# EAGLE design xiao-extension (EAGLE 9.6.2)
CNAME: BotaLab; CREVISION: 1.1; DESIGNER: botamochi6277
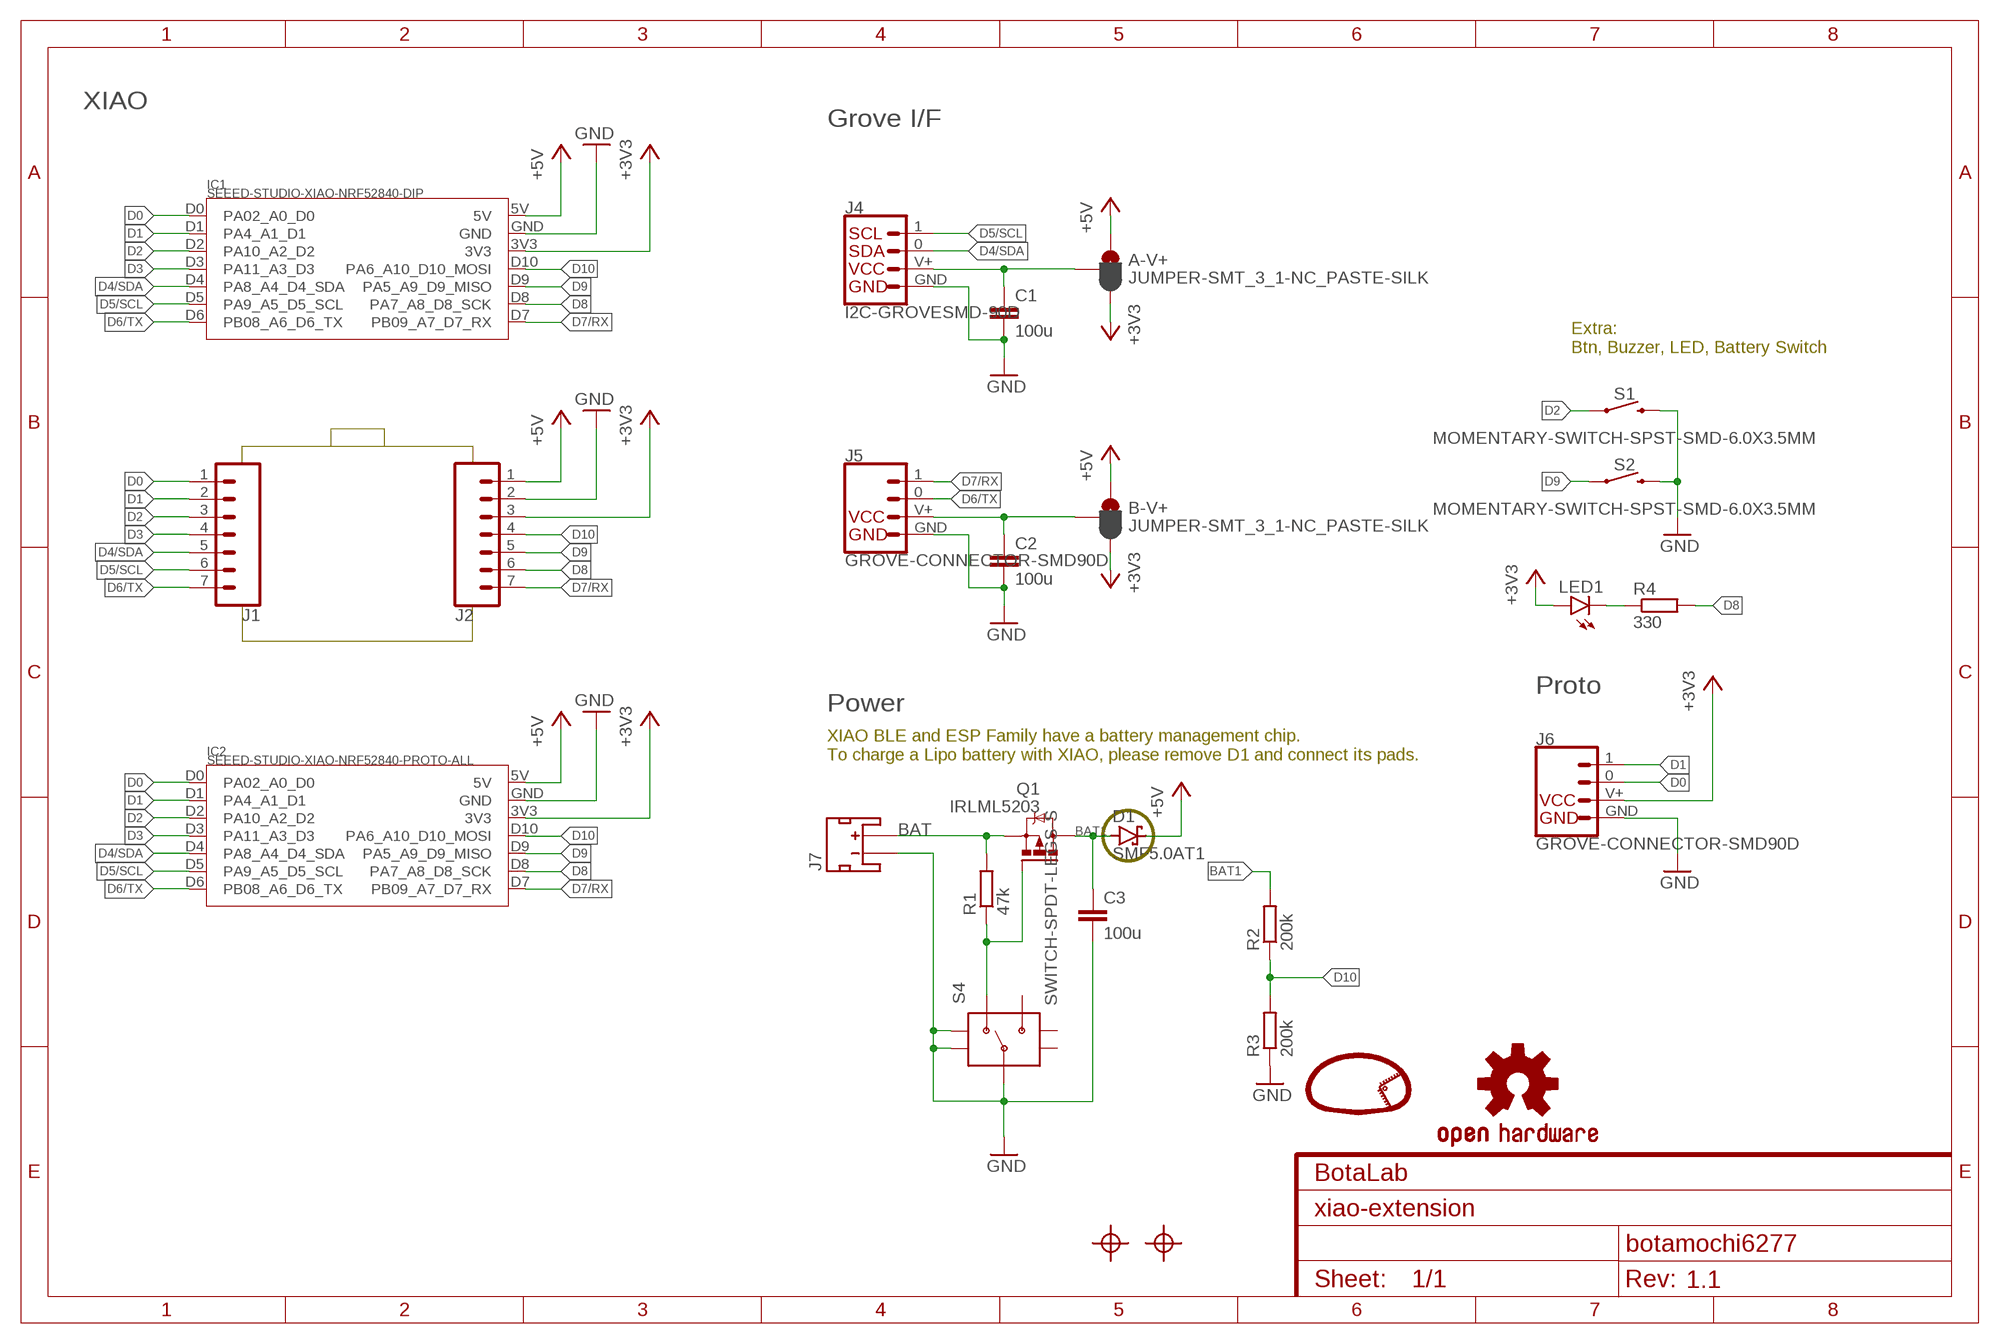
[diagram p0: schematic, sheet 1]

## Parts
A-V+  JUMPER-SMT_3_1-NC_PASTE-SILK  [SMT-JUMPER_3_1-NC_PASTE_SILK]
B-V+  JUMPER-SMT_3_1-NC_PASTE-SILK  [SMT-JUMPER_3_1-NC_PASTE_SILK]
C1  100u  C-EUC3216  [C3216]
C2  100u  C-EUC3216  [C3216]
C3  100u  C-EUC3216  [C3216]
D1  SMF5.0AT1  [SOD123FL]
H1  HOLE-SILK-2.1  [MOUNTING_HOLE_SILK_2.1]
H2  HOLE-SILK-2.1  [MOUNTING_HOLE_SILK_2.1]
IC1  SEEED-STUDIO-XIAO-NRF52840-DIP  [XIAO-NRF52840-DIP]
IC2  SEEED-STUDIO-XIAO-NRF52840-PROTO-ALL  [XIAO-SMD-PROTO]
J1  CONN_07NO_SILK  [1X07_NO_SILK]
J2  CONN_07NO_SILK  [1X07_NO_SILK]
J4  I2C-GROVESMD-90D  [HW4-SMD-2.0-90D]
J5  GROVE-CONNECTOR-SMD90D  [HW4-SMD-2.0-90D]
J6  GROVE-CONNECTOR-SMD90D  [HW4-SMD-2.0-90D]
J7  JST_2MM_MALE  [JST-2-SMD]
LED1  LEDCHIP-LED0603  [CHIP-LED0603]
LOGO1  LOGO  [LOGO]
LOGO2  OSHW-LOGOS  [OSHW-LOGO-S]
Q1  IRLML5203  [MICRO3]
R1  47k  R-EU_R0603  [R0603]
R2  200k  R-EU_R0603  [R0603]
R3  200k  R-EU_R0603  [R0603]
R4  330  R-EU_R0603  [R0603]
S1  MOMENTARY-SWITCH-SPST-SMD-6.0X3.5MM  [TACTILE_SWITCH_SMD_6.0X3.5MM]
S2  MOMENTARY-SWITCH-SPST-SMD-6.0X3.5MM  [TACTILE_SWITCH_SMD_6.0X3.5MM]
S4  SWITCH-SPDT-LEGS-S  [SWITCH_SPST_SMD_A]

## Nets
+3V3 [pwr]: A-V+.3 B-V+.3 IC1.3V3 IC2.3V3 J2.3 J6.V+(VCC) LED1.A
+5V [pwr]: A-V+.1 B-V+.1 D1.C IC1.5V IC2.5V J2.1
BAT [pwr]: J7.2(+) Q1.2(S) R1.2
BAT1 [pwr]: C3.1 D1.A Q1.3(D) R2.2
D0: IC1.D0(PA02_A0_D0) IC2.D0(PA02_A0_D0) J1.1 J6.0
D1: IC1.D1(PA4_A1_D1) IC2.D1(PA4_A1_D1) J1.2 J6.1
D2: IC1.D2(PA10_A2_D2) IC2.D2(PA10_A2_D2) J1.3 S1.1
D3: IC1.D3(PA11_A3_D3) IC2.D3(PA11_A3_D3) J1.4
D4/SDA: IC1.D4(PA8_A4_D4_SDA) IC2.D4(PA8_A4_D4_SDA) J1.5 J4.0
D5/SCL: IC1.D5(PA9_A5_D5_SCL) IC2.D5(PA9_A5_D5_SCL) J1.6 J4.1
D6/TX: IC1.D6(PB08_A6_D6_TX) IC2.D6(PB08_A6_D6_TX) J1.7 J5.0
D7/RX: IC1.D7(PB09_A7_D7_RX) IC2.D7(PB09_A7_D7_RX) J2.7 J5.1
D8: IC1.D8(PA7_A8_D8_SCK) IC2.D8(PA7_A8_D8_SCK) J2.6 R4.2
D9: IC1.D9(PA5_A9_D9_MISO) IC2.D9(PA5_A9_D9_MISO) J2.5 S2.1
D10: IC1.D10(PA6_A10_D10_MOSI) IC2.D10(PA6_A10_D10_MOSI) J2.4 R2.1 R3.2
GND [pwr]: C1.2 C2.2 C3.2 IC1.GND IC2.GND J2.2 J4.GND J5.GND J6.GND J7.1(-) R3.1 S1.2 S2.2 S4.2(P) S4.L$1 S4.L$2
N$1 [pwr]: A-V+.2 C1.1 J4.V+
N$2 [pwr]: B-V+.2 C2.1 J5.V+(VCC)
N$3: Q1.1(G) R1.1 S4.1(O)
N$4: LED1.C R4.1
Unconnected: J7.NC1(PAD1) J7.NC2(PAD2) S4.3(S) S4.L$3 S4.L$4

## Notes on the sheet
- XIAO
- Grove I/F
- Extra:
  Btn, Buzzer, LED, Battery Switch
- Proto
- Power
- XIAO BLE and ESP Family have a battery management chip.
  To charge a Lipo battery with XIAO, please remove D1 and connect its pads.

## Library data of the parts
A-V+ B-V+ = Botamochi-Jumper:JUMPER-SMT_3_1-NC_PASTE
C1-C3 = rcl:C-EU: CAPACITOR, European symbol; SPICEPREFIX: C
D1 = diode:SMF5.0AT1: 200 W Transient Voltage Suppressor Source: Data sheet <http://www.onsemi.com/pub_link/Collateral/SMF5.0AT1-D.PDF>
H1 H2 = Botamochi-Hole:HOLE
IC1 IC2 = Seeed Studio XIAO:SEEED-STUDIO-XIAO-NRF52840
J1 J2 = SparkFun-Connectors:CONN_07: Multi connection point. Often used as Generic Header-pin footprint for 0.1 inch spaced/style header connections On any of the 0.1 inch spaced packages, you can populate with these: Break Away Headers - Straight <https://www.sparkfun.com/products/116> (PRT-00116) Break Away Male Headers - Right Angle <https://www.sparkfun.com/products/553> (PRT-00553) Female Headers <https://www.sparkfun.com/products/115> (PRT-00115) Break Away Headers - Machine Pin <https://www.sparkfun.com/products/117> (PRT-00117) Break Away Female Headers - Swiss Machine Pin <https://www.sparkfun.com/products/743> (PRT-00743) For SCREWTERMINALS and SPRING TERMINALS visit here: Screw Terimnals on SparkFun.com <https://www.sparkfun.com/search/results?term=Screw+Terminals> (5mm/3.5mm/2.54mm spacing) This device is also useful as a general connection point to wire up your design to another part of your project. Our various solder wires solder well into these plated through hole pads. Hook-Up Wire - Assortment (Stranded, 22 AWG) <https://www.sparkfun.com/products/11375> (PRT-11375) Hook-Up Wire - Assortment (Solid Core, 22 AWG) <https://www.sparkfun.com/products/11367> (PRT-11367) View the entire wire category on our website here <https://www.sparkfun.com/categories/141> Special notes: Molex polarized connector foot print use with SKU : PRT-08231 with associated crimp pins and housings. 1MM SMD Version SKU: PRT-10208 NOTES ON THE VARIANTS LOCK and LOCK_LONGPADS... This footprint was designed to help hold the alignment of a through-hole component (i.e. 6-pin header) while soldering it into place. You may notice that each hole has been shifted either up or down by 0.005 of an inch from it's more standard position (which is a perfectly straight line). This slight alteration caused the pins (the squares in the middle) to touch the edges of the holes. Because they are alternating, it causes a "brace" to hold the component in place. 0.005 has proven to be the perfect amount of "off-center" position when using our standard breakaway headers. Although looks a little odd when you look at the bare footprint, once you have a header in there, the alteration is very hard to notice. Also,if you push a header all the way into place, it is covered up entirely on the bottom side.
J4 = SEEED-GROVE-CONNECTOR:I2C-GROVE
J5 J6 = SEEED-GROVE-CONNECTOR:GROVE-CONNECTOR-SMD
J7 = SparkFun-Connectors:JST_2MM_MALE: JST 2MM MALE RA CONNECTOR Two pin, compact surface mount connector. Commonly used as a battery input connection point. We really like the solid locking feeling and high current rating on these small connectors. We use these all the time as battery connectors. Mates to single-cell LiPo batteries. Here is the connector we sell at SparkFun: JST Right Angle Connector - White <https://www.sparkfun.com/products/8612> (PRT-08612) Datasheet <http://www.sparkfun.com/datasheets/Prototyping/Connectors/JST-Horizontal.pdf> It was used on these SparkFun products: SparkFun MOSFET Power Controller <https://www.sparkfun.com/products/11214> (PRT-11214) SparkFun Battery Babysitter - LiPo Battery Manager <https://www.sparkfun.com/products/13777> (PRT-13777) And many, many others that required a lipo battery connection.; PROD_ID: CONN-11443; SF_ID: PRT-08612
LED1 = led:LED: LED OSRAM: - CHIPLED LG R971, LG N971, LY N971, LG Q971, LY Q971, LO R971, LY R971 LH N974, LH R974 LS Q976, LO Q976, LY Q976 LO Q996 - Hyper CHIPLED LW Q18S LB Q993, LB Q99A, LB R99A - SideLED LS A670, LO A670, LY A670, LG A670, LP A670 LB A673, LV A673, LT A673, LW A673 LH A674 LY A675 LS A676, LA A676, LO A676, LY A676, LW A676 LS A679, LY A679, LG A679 - Hyper Micro SIDELED® LS Y876, LA Y876, LO Y876, LY Y876 LT Y87S - SmartLED LW L88C, LW L88S LB L89C, LB L89S, LG L890 LS L89K, LO L89K, LY L89K LS L896, LA L896, LO L896, LY L896 - TOPLED LS T670, LO T670, LY T670, LG T670, LP T670 LSG T670, LSP T670, LSY T670, LOP T670, LYG T670 LG T671, LOG T671, LSG T671 LB T673, LV T673, LT T673, LW T673 LH T674 LS T676, LA T676, LO T676, LY T676, LB T676, LH T676, LSB T676, LW T676 LB T67C, LV T67C, LT T67C, LS T67K, LO T67K, LY T67K, LW E67C LS E67B, LA E67B, LO E67B, LY E67B, LB E67C, LV E67C, LT E67C LW T67C LS T679, LY T679, LG T679 LS T770, LO T770, LY T770, LG T770, LP T770 LB T773, LV T773, LT T773, LW T773 LH T774 LS E675, LA E675, LY E675, LS T675 LS T776, LA T776, LO T776, LY T776, LB T776 LHGB T686 LT T68C, LB T68C - Hyper Mini TOPLED® LB M676 - Mini TOPLED Santana® LG M470 LS M47K, LO M47K, LY M47K Source: http://www.osram.convergy.de LUXEON: - LUMILED® LXK2-PW12-R00, LXK2-PW12-S00, LXK2-PW14-U00, LXK2-PW14-V00 LXK2-PM12-R00, LXK2-PM12-S00, LXK2-PM14-U00 LXK2-PE12-Q00, LXK2-PE12-R00, LXK2-PE12-S00, LXK2-PE14-T00, LXK2-PE14-U00 LXK2-PB12-K00, LXK2-PB12-L00, LXK2-PB12-M00, LXK2-PB14-N00, LXK2-PB14-P00, LXK2-PB14-Q00 LXK2-PR12-L00, LXK2-PR12-M00, LXK2-PR14-Q00, LXK2-PR14-R00 LXK2-PD12-Q00, LXK2-PD12-R00, LXK2-PD12-S00 LXK2-PH12-R00, LXK2-PH12-S00 LXK2-PL12-P00, LXK2-PL12-Q00, LXK2-PL12-R00 Source: www.luxeon.com KINGBRIGHT: KA-3528ASYC Source: www.kingbright.com
LOGO1 = botamochi-symbol:LOGO
LOGO2 = SparkFun-Aesthetics:OSHW-LOGO: Open-Source Hardware (OSHW) Logo This logo indicates the piece of hardware it is found on incorporates a OSHW license and/or adheres to the definition of open source hardware found here: http://freedomdefined.org/OSHW
Q1 = transistor-power:IRLML5203: HEXFET P-Channel Power MOSFET
R1-R4 = rcl:R-EU_: RESISTOR, European symbol; SPICEPREFIX: R
S1 S2 = SparkFun-Switches:MOMENTARY-SWITCH-SPST: Momentary Switch (Pushbutton) - SPST Normally-open (NO) SPST momentary switches (buttons, pushbuttons). Variants PTH-12MM - 12mm square, through-hole Momentary Pushbutton Switch - 12mm Square <https://www.sparkfun.com/products/9190> (COM-09190) PTH-6.0MM, PTH-6.0MM-KIT - 6.0mm square, through-hole Mini Pushbutton Switch <https://www.sparkfun.com/products/97> (COM-00097) KIT package intended for soldering kit's - only one side of pads' copper is exposed. PTH-RIGHT-ANGLE-KIT - Right-angle, through-hole Right Angle Tactile Button <https://www.sparkfun.com/products/10791> - Used on SparkFun BigTime Watch Kit <https://www.sparkfun.com/products/11734> SMD-12MM - 12mm square, surface-mount Tactile Button - SMD (12mm) <https://www.sparkfun.com/products/12993> (COM-12993) Used on SparkFun PicoBoard <https://www.sparkfun.com/products/11888> SMD-4.5MM - 4.5mm Square Trackball Switch Used on SparkFun Blackberry Trackballer Breakout <https://www.sparkfun.com/products/13169> SMD-4.6MMX2.8MM - 4.60mm x 2.80mm, surface mount Used on SparkFun SAMD21 Mini Breakout <https://www.sparkfun.com/products/13664> SMD-5.2MM, SMD-5.2-REDUNDANT - 5.2mm square, surface-mount Mini Pushbutton Switch - SMD <https://www.sparkfun.com/products/8720> (COM-08720) Used on Arduino Pro Mini <https://www.sparkfun.com/products/11114> REDUNDANT package connects both switch circuits together SMD-6.0X3.5MM - 6.0 x 3.5mm, surface mount Momentary Reset Switch SMD <https://www.sparkfun.com/products/8229> (COM-08229) SMD-6.2MM-TALL - 6.2mm square, surface mount Tactile Button - SMD (6mm) <https://www.sparkfun.com/products/12992> Used on SparkFun Digital Sandbox <https://www.sparkfun.com/products/12651> SMD-RIGHT-ANGLE - Right-angle, surface mount Used on SparkFun Block for Intel® Edison - Arduino <https://www.sparkfun.com/products/13036>; PROD_ID: SWCH-00815; SF_SKU: COM-08229
S4 = Botamochi-Switch:SWITCH-SPDT-LEGS

## Net classes
0 default: width 0.5 mm
1 pwr: width 0.75 mm, clearance 0.25 mm

## Board
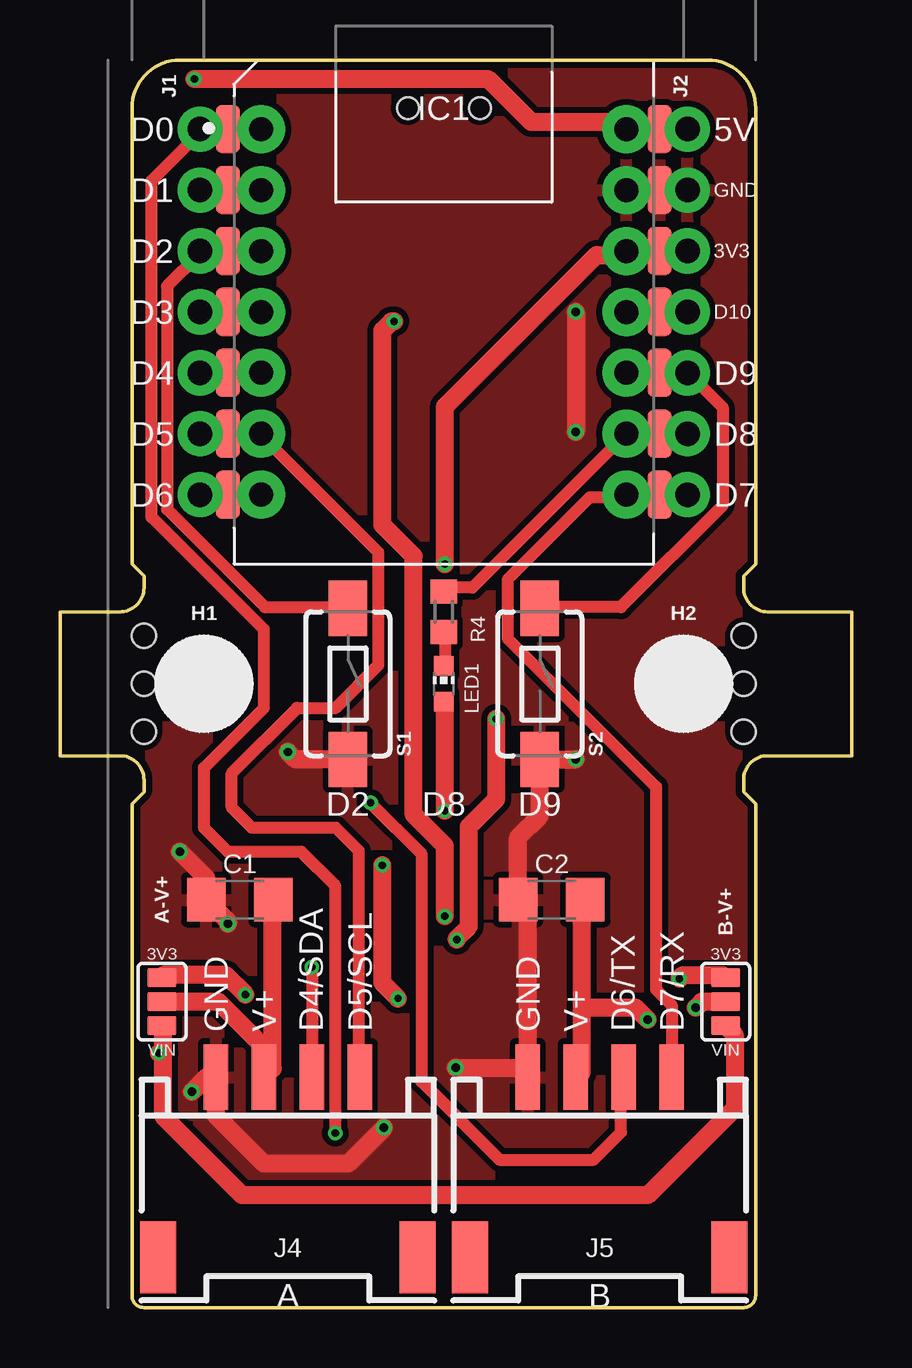
[diagram p1: board, top side]
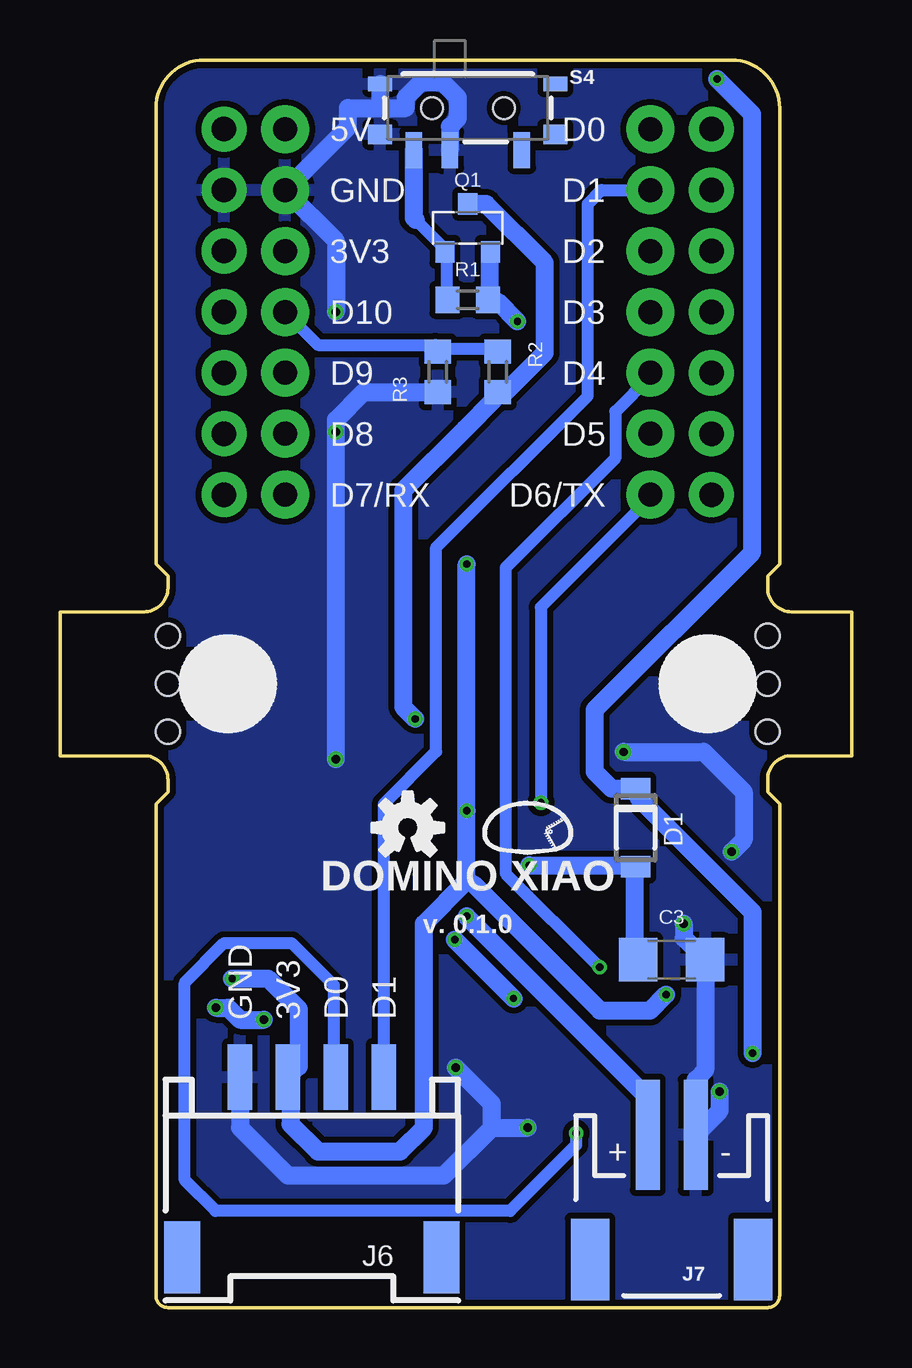
[diagram p2: board, bottom side, seen from below]

Size 33 x 52 mm. Coordinates in mm from the lower left corner, seen from the top.
Outline: 29,0.5 29,21 28.5,21.5 28.5,22 arc-90 29.5,23 33,23 33,29 29.5,29 arc-90 28.5,30 28.5,30.5 29,31 29,50 arc90 27,52 5,52 arc90 3,50 3,31 3.5,30.5 3.5,30 arc-90 2.5,29 0,29 0,23 2.5,23 arc-90 3.5,22 3.5,21.5 3,21 3,0.5 arc90 3.5,0 28.5,0 arc90 29,0.5
Copper layers (1*16): Top 0.035mm / dielectric 1.5mm / Bottom 0.035mm
Design rules "ssci_SeeedStudio_2layer_DRU_no_angle *": minimum track width 0.5mm, minimum drill 12mil, track to track 6mil, track to pad 6mil, pad to pad 6mil, via to via 6mil, smd to smd 0mil, copper to edge 10mil, drill to drill 10mil, minimum pad ring 10mil, minimum via ring 6mil, stop-mask expansion 2mil, vias tented up to drill 25mil, thermal gap 10mil
Holes 1 mm at 28.5,26 28.5,28 28.5,24 3.5,28 3.5,26 3.5,24

### Footprints (pad centres in the part's own frame; a part is rotated, then mirrored left to right if it is on the bottom)
SMT-JUMPER_3_1-NC_PASTE_SILK = smd 0.75 x 1.2: 1 -1,0; 2 0,0; 3 1,0
C3216 = smd 1.6 x 1.8: 1 -1.4,0; 2 1.4,0
SOD123FL = smd 0.91 x 1.22: A 1.625,0; C -1.625,0
MOUNTING_HOLE_SILK_2.1 = hole 2.1: 0,0
XIAO-NRF52840-DIP = drill 1 pad 2: 3V3 7.62,-7.96; 5V 7.62,-2.88; D0 -7.62,-2.88; D1 -7.62,-5.42; D2 -7.62,-7.96; D3 -7.62,-10.5; D4 -7.62,-13.04; D5 -7.62,-15.58; D6 -7.62,-18.12; D7 7.62,-18.12; D8 7.62,-15.58; D9 7.62,-13.04; D10 7.62,-10.5; GND 7.62,-5.42
XIAO-SMD-PROTO = smd 1 x 2: 3V3 9,-7.96; 5V 9,-2.88; D0 -9,-2.88; D1 -9,-5.42; D2 -9,-7.96; D3 -9,-10.5; D4 -9,-13.04; D5 -9,-15.58; D6 -9,-18.12; D7 9,-18.12; D8 9,-15.58; D9 9,-13.04; D10 9,-10.5; GND 9,-5.42
1X07_NO_SILK = drill 1.016 pad 1.88: 1 0,0; 2 2.54,0; 3 5.08,0; 4 7.62,0; 5 10.16,0; 6 12.7,0; 7 15.24,0
HW4-SMD-2.0-90D = smd 1.01 x 2.74: 0 -1,-0.1; 1 -3,-0.1; GND 3,-0.1; V+ 1,-0.1 | smd 1.5 x 3: SS1 -5.4,7.4; SS2 5.4,7.4
JST-2-SMD = smd 1 x 4.6: 1 -1,-3.7; 2 1,-3.7 | smd 1.6 x 3.4: NC1 -3.4,1.5; NC2 3.4,1.5
CHIP-LED0603 = smd 0.8 x 0.8: A 0,-0.75; C 0,0.75
MICRO3 = smd 0.8 x 0.9: 1 -0.95,-1; 2 0.95,-1; 3 0,1
R0603 = smd 1 x 1.1: 1 -0.85,0; 2 0.85,0
TACTILE_SWITCH_SMD_6.0X3.5MM = smd 2.3 x 1.6: 1 -3.15,0; 2 3.15,0
SWITCH_SPST_SMD_A = smd 0.7 x 1.5: 1 -2.25,-1.75; 2 -0.75,-1.75; 3 2.25,-1.75 | smd 1 x 0.6: L$1 -3.65,1; L$4 3.65,1 | smd 1 x 0.8: L$2 -3.65,-1.1; L$3 3.65,-1.1 | hole 0.9: -1.5,0; 1.5,0

### Placement (x,y rotation side)
A-V+  4.25,12.75 90 top
B-V+  27.75,12.75 90 top
C1  7.5,17 180 top
C2  20.5,17 180 top
C3  7.5,14.5 0 bottom
D1  9,20 270 bottom
H1  6,26 0 top
H2  26,26 0 top
IC1  16,52 0 top
IC2  16,52 0 top
J1  5.84,49.12 270 top
J2  26.16,49.12 270 top
J4  9.5,9.5 180 top
J5  22.5,9.5 180 top
J6  22.5,9.5 180 bottom
J7  7.5,3.5 180 bottom
LED1  16,26 0 top
LOGO1  13.5,20 0 bottom
LOGO2  18.5,20 0 bottom
Q1  16,45 0 bottom
R1  16,42 0 bottom
R2  14.75,39 270 bottom
R3  17.25,39 90 bottom
R4  16,29 90 top
S1  12,26 270 top
S2  20,26 270 top
S4  16,50 0 bottom

### Tracks (layer width: path | path; a pad name or v marks a point on that pad's centre or on a via)
+3V3  (via drill 0.3)
  Top 0.75: J2.3 26,44.04 25.02,44.04 IC2.3V3 24.69,44.04 23.71,44.04 IC1.3V3 23.39,43.87 22.37,43.87 16.05,37.55 v16.05,30.99 | v16.05,20.71 16.05,25.12 LED1.A | v7.73,13.05 6.91,13.86 4.3,13.86 A-V+.3 | v25.82,13.71 25.98,13.86 27.63,13.86 B-V+.3
  Bottom 0.75: 16.05,17.78 v16.05,20.71 v16.05,30.99 | 16.05,17.78 17.83,15.99 17.83,7.49 18.82,6.5 22.25,6.5 23.39,7.64 23.39,9.46 J6.V+ 23.05,10.05 23.05,12.44 24.32,13.71 v25.82,13.71 | v7.73,13.05 8.39,12.38 10.49,12.38 15.72,17.61 16.05,17.78
+5V  (via drill 0.3)
  Top 0.75: J2.1 26,49.26 25.02,49.26 IC2.5V 24.69,49.26 23.71,49.26 IC1.5V 23.39,49.42 19.64,49.42 17.84,51.21 v5.61,51.21 | 4.3,10.6 4.3,7.97 7.59,4.69 24.51,4.69 28.13,8.31 28.13,11.37 B-V+.1 | 4.3,10.6 4.3,11.74 A-V+.1 | v4.13,10.6 4.3,10.6
  Bottom 0.75: v4.13,10.6 4.13,16.48 8.87,21.22 8.87,21.53 D1.C 10,21.62 10.71,22.33 10.71,24.91 4.14,31.48 4.14,49.74 v5.61,51.21
BAT  (via drill 0.3)
  Top 0.75: v13.93,41.1 13.82,41.1 13.44,40.72 13.44,32.62 14.74,31.32 14.74,20.55 16.05,19.25 v16.05,16.31
  Bottom 0.75: Q1.2 15.07,43.87 15.07,42.08 R1.2 14.74,41.92 v13.93,41.1 | v16.05,16.31 8.54,8.81 8.54,7.34 J7.2
BAT1  (via drill 0.3)
  Top 0.75: v13.44,18.43 13.44,13.54 v14.09,12.88 | v16.54,15.33 16.54,15.38 17.05,15.9 17.05,20.05 18.19,21.19 v18.19,24.53
  Bottom 0.75: C3.1 9.04,14.52 9.04,18.27 D1.A 9.36,18.43 v13.44,18.43 | Q1.3 15.88,45.99 15.23,45.99 12.79,43.55 12.79,39.8 14.42,38.16 14.74,38.16 R2.2 14.91,37.84 16.12,36.62 18.69,34.06 18.69,25.03 v18.19,24.53 | v16.54,15.33 v14.09,12.88
D0  (via drill 0.3)
  Top 0.5: v11.48,7.28 11.48,17.57 10.05,19 7,19 6,20 6,22.5 8.5,25 8.5,28.26 3.82,32.95 3.82,46.97 5.77,48.93 J1.1 5.94,49.26 6.91,49.26 IC2.D0 7.24,49.09 8.22,49.09 IC1.D0
  Bottom 0.5: v11.48,7.28 11.48,6.78 14.23,4.02 26.52,4.02 27.8,5.31 27.8,13.54 26.15,15.19 23.34,15.19 21.59,13.44 21.59,9.62 J6.0
D1
  Top 0.5: J1.2 5.94,46.65 6.91,46.65 IC2.D1 7.24,46.65 8.22,46.65 IC1.D1
  Bottom 0.5: J6.1 19.5,20.98 17.31,23.17 17.31,31.68 11,38 11,46 10.42,46.58 IC1.D1
D2
  Top 0.5: S1.1 11.97,29.2 8.54,29.2 4.47,33.27 4.47,42.57 5.77,43.87 J1.3 5.94,44.04 6.91,44.04 IC2.D2 7.24,44.04 8.22,44.04 IC1.D2
D3
  Top 0.5: J1.4 5.94,41.59 6.91,41.59 IC2.D3 7.24,41.59 8.22,41.59 IC1.D3
D4/SDA  (via drill 0.3)
  Top 0.5: J1.5 5.94,38.98 6.91,38.98 IC2.D4 7.24,38.98 8.22,38.98 IC1.D4 | v10.5,14.19 10.5,9.62 J4.0
  Bottom 0.5: v10.5,14.19 14.42,18.1 14.42,30.83 9.85,35.39 9.85,37.35 8.38,38.82 IC1.D4
D5/SCL
  Top 0.5: J1.6 5.94,36.53 6.91,36.53 IC2.D5 7.24,36.37 8.22,36.37 IC1.D5 8.38,36.37 13.28,31.48 13.28,26.77 11.5,25 9.88,25 7.17,22.28 7.17,20.83 8,20 11.5,20 12.46,19.04 12.46,9.62 J4.1
D6/TX  (via drill 0.3)
  Top 0.5: J1.7 5.94,33.92 6.91,33.92 IC2.D6 7.24,33.92 8.22,33.92 IC1.D6 | v12.95,21.04 15.07,18.92 15.07,9.42 18.32,6.17 22.25,6.17 23.39,7.31 23.39,9.46 J5.0
  Bottom 0.5: v12.95,21.04 12.95,29.2 8.38,33.76 IC1.D6
D7/RX
  Top 0.5: J2.7 26,33.92 25.02,33.92 IC2.D7 24.86,33.92 23.71,33.92 IC1.D7 23.55,33.76 22.08,33.76 18.66,30.34 18.66,27.89 24.84,21.7 24.84,13.26 25.5,12.6 J5.1
D8
  Top 0.5: J2.6 26,36.53 25.02,36.53 IC2.D8 24.86,36.53 23.71,36.53 IC1.D8 23.55,36.37 17.19,30.01 16.05,30.01 R4.2
D9
  Top 0.5: S2.1 20.12,29.2 23.39,29.2 27.63,33.44 27.63,37.51 26.32,38.82 J2.5 26,38.98 25.02,38.98 IC2.D9 24.86,38.98 23.71,38.98 IC1.D9
D10
  Top 0.5: J2.4 26,41.59 25.02,41.59 IC2.D10 24.86,41.59 23.71,41.59 IC1.D10
  Bottom 0.5: R2.1 14.91,39.96 17.19,39.96 R3.2 17.35,40.12 22.25,40.12 23.55,41.43 IC1.D10
GND  (via drill 0.35)
  Top 0.75: v5,19 6.1,17.9 C1.2 7,16.1 v7,16 | S1.2 9.81,22.85 v9.5,23.16 | v21.5,22.85 S2.2 20,20.5 19.1,19.6 C2.2 19.5,16.6 J5.GND 19.1,10 v16.5,10 | v21.5,41.5 v21.5,36.5 | IC1.GND IC2.GND J2.2 | v5.5,9 6.1,9.6 J4.GND 6.5,8 8.5,6 12,6 v13.5,7.5
  Bottom 0.75: v9.5,23.16 6.16,23.16 4.5,21.5 4.5,19.5 v5,19 | v7,16 7,15.4 C3.2 6.1,9.9 6.5,9.5 J7.1 5.5,8.2 v5.5,9 | 19.5,50 21,50 21,49.2 IC1.GND 21.5,44.46 v21.5,41.5 | 19.5,50 18.58,50 18.58,50.45 17.95,51.08 17.05,51.08 16.42,50.45 16.42,49.55 16.75,49.22 S4.2 | v21.5,22.85 v21.5,36.5 21.5,37 20.35,38.15 R3.1 | J6.GND 25.5,7.5 23.5,5.5 17,5.5 15,7.5 | 15,7.5 15,8.5 v16.5,10 | 15,7.5 v13.5,7.5 | S4.L$1 19.65,50.15 19.5,50
  pour Top: 1.5,53 32,53 32,-0.5 1.5,-0.5
  pour Bottom: 2.5,53 31,53 31,-1 2.5,-1
N$1
  Top 0.75: C1.1 8.87,16.96 8.87,9.95 8.54,9.62 J4.V+ 8.5,10.84 8.51,10.85 6.61,12.75 A-V+.2
N$2  (via drill 0.35)
  Top 0.75: 21.76,12.5 21.76,9.79 21.59,9.62 J5.V+ | 21.76,12.5 21.76,16.96 C2.1 | B-V+.2 26.75,12.75 v26.5,12.5 | v24.5,12 24,12.5 21.76,12.5
  Bottom 0.75: v26.5,12.5 26,12.5 25.5,12 v24.5,12
N$3
  Bottom 0.5: R1.1 16.86,42.08 16.86,43.87 Q1.1 17.03,44.2 18.17,45.34
  Bottom 0.75: 18.17,45.34 18.25,45.42 S4.1
N$4
  Top 0.5: LED1.C 16.05,26.91 16.05,28.05 R4.1

### Text on the board
tNames: D0 | 5V | D1 | GND | D2 | 3V3 | D3 | D10 | D4 | D9 | D5 | D8 | D6 | D7 | D2 | D8 | D9 | 3V3 | 3V3 | GND | V+ | D4/SDA | D5/SCL | GND | V+ | D6/TX | D7/RX | VIN | VIN | A | B
bNames: D0 | 5V | D1 | GND | D2 | 3V3 | D3 | D10 | D4 | D9 | D5 | D8 | D6/TX | D7/RX | DOMINO XIAO | v. 0.1.0 | D1 | D0 | 3V3 | GND | - | +
_tNames: J1 | J2 | IC1 | H1 | H2 | C1 | C2 | J4 | J5
_bNames: J8 | J6 | J7 | C3 | J9 | J3